# Altium project air qulity monitor.PrjPcb
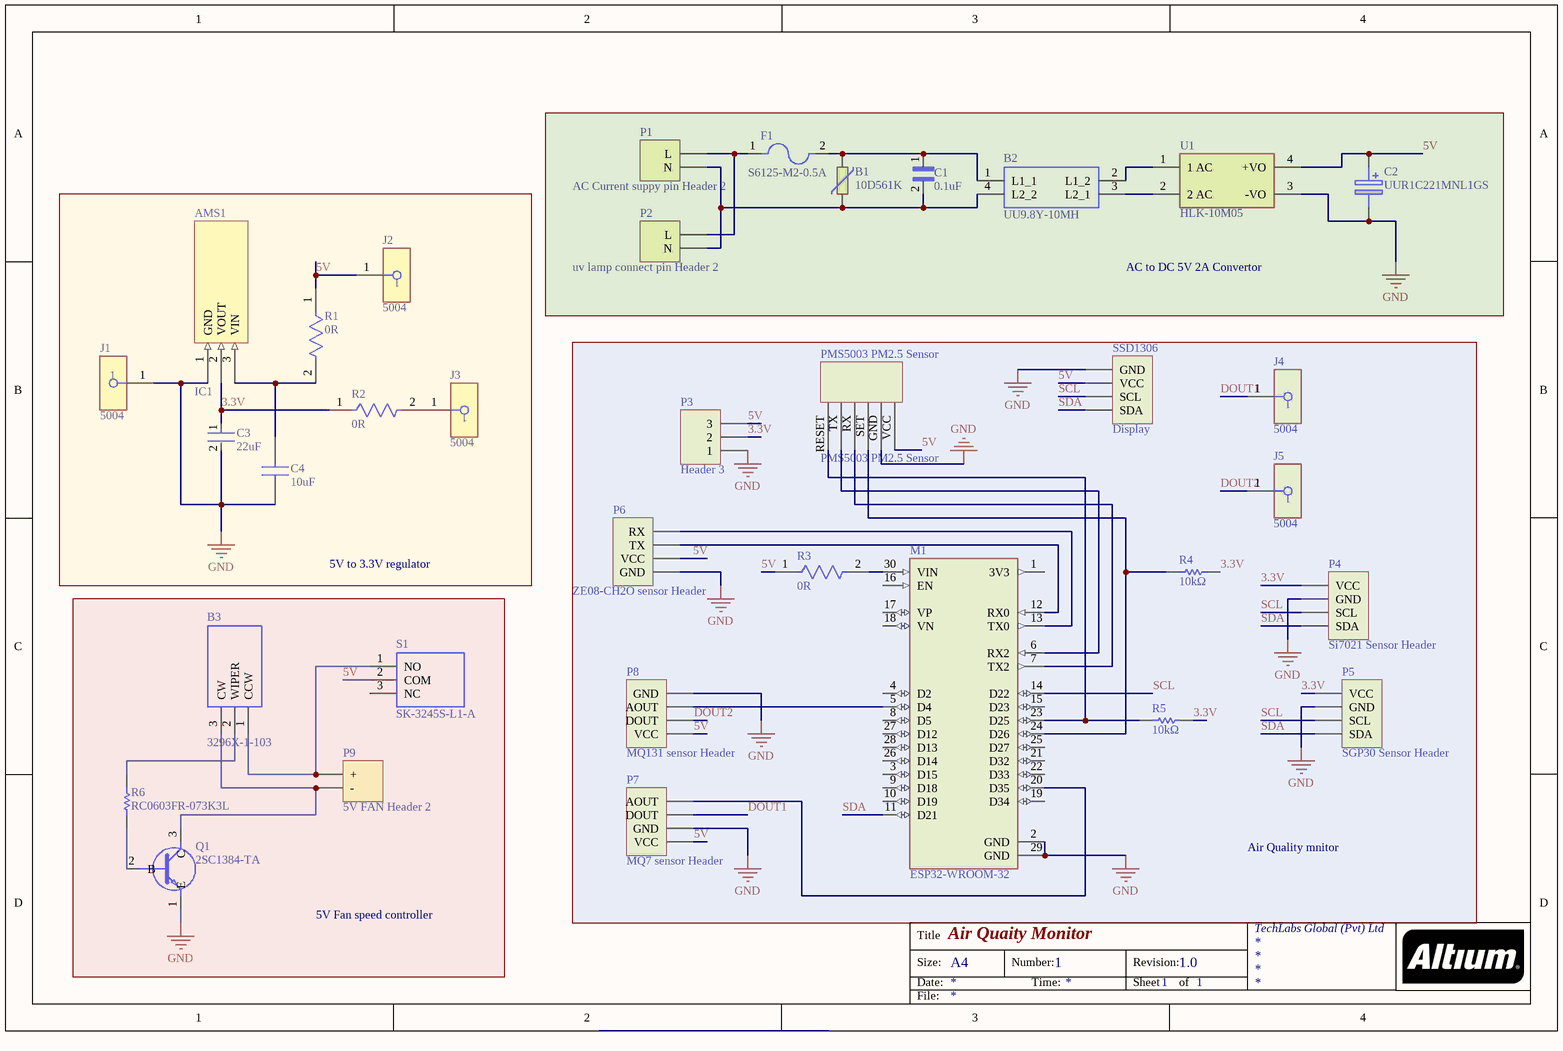
[diagram p0: air qulity monitor.SchDoc]
1 sheet, 35 parts. Net scope: global (net labels, ports and power ports of the same name join across sheets).
Board file: air qulity monitor with air purifire.PcbDoc

## Sheet air qulity monitor.SchDoc: Air Quaity Monitor
size A4; Organization: TechLabs Global (Pvt) Ltd; DocumentNumber: 1; Revision: 1.0; SheetNumber: 1; SheetTotal: 1

### Parts
AMS1  IC1  [SOT89-150P350X150-3N]
B1  10D561K  [10D561K]
B2  UU9.8Y-10MH  [UU98Y10MH]
B3  3296X-1-103  [3296X1223LF]
C1  0.1uF  [MPX-104K275VAC-C-D2]
C2  UUR1C221MNL1GS  [CAPAE830X1050N]
C3  22uF  [FP-GRM219-0_2-0_15-IPC_A]
C4  10uF  [CAPC1005X70N]
F1  S6125-M2-0.5A  [CAPC6125X25N]
J1  5004  [FP-5004-MFG]
J2  5004  [FP-5004-MFG]
J3  5004  [FP-5004-MFG]
J4  5004  [FP-5004-MFG]
J5  5004  [FP-5004-MFG]
M1  ESP32-WROOM-32  [ESP32-DEVKIT-V1]
P1  AC Current suppy pin Header 2  [HDR1X2]
P2  uv lamp connect pin Header 2  [HDR1X2]
P3  Header 3  [HDR1X3]
P4  Si7021 Sensor Header  [HDR1X4]
P5  SGP30 Sensor Header  [HDR1X4]
P6  ZE08-CH2O sensor Header  [HDR1X4]
P7  MQ7 sensor Header  [HDR1X4]
P8  MQ131 sensor Header  [HDR1X4]
P9  5V FAN Header 2  [HDR1X2]
PMS5003_PM2.5_Sensor  PMS5003 PM2.5 Sensor  [PMS5003 PM2.5 Sensor]
Q1  2SC1384-TA  [2SC1384-TA]
R1  0R  [FP-RC0402-0_4-IPC_A]
R2  0R  [FP-RC0402-0_4-IPC_A]
R3  0R  [FP-RC0402-0_4-IPC_A]
R4  10kΩ  [RESC1005X40X25LL05T10]
R5  10kΩ  [RESC1005X40X25LL05T10]
R6  RC0603FR-073K3L  [RESC1608X55X25ML10T15]
S1  SK-3245S-L1-A  [SK3245SL1A]
SSD1306  Display  [HDR1X4]
U1  HLK-10M05  [FP-HLK-10M05-MFG]

### Blocks framed on the sheet
AC to DC 5V 2A Convertor: B1 B2 C1 C2 F1 P1 P2 U1
5V to 3.3V regulator: AMS1 C3 C4 J1-J3 R1 R2
Air Quality mnitor: J4 J5 M1 P3-P8 PMS5003_PM2.5_Sensor R3-R5 SSD1306
5V Fan speed controller: B3 P9 Q1 R6 S1

### Nets
GND: AMS1.1(GND) C2.2(-) C3.2 C4.1 J1.1 M1.2(GND) M1.29(GND) P3.1 P4.2(GND) P5.2(GND) P6.1(GND) P7.2(GND) P8.4(GND) PMS5003_PM2.5_Sensor.GND Q1.1(E) SSD1306.1(GND) U1.3(-VO)
3.3V: AMS1.2(VOUT) C3.1 P3.2 P4.1(VCC) P5.1(VCC) R2.1 R4.2 R5.2
5V: C2.1(+) J2.1 P3.3 P6.2(VCC) P7.1(VCC) P8.1(VCC) PMS5003_PM2.5_Sensor.VCC R1.1 R3.1 S1.2(COM) SSD1306.2(VCC) U1.4(+VO)
DOUT1: J4.1 P7.3(DOUT)
DOUT2: J5.1 P8.2(DOUT)
SCL: M1.14(D22) P4.3(SCL) P5.3(SCL) SSD1306.3(SCL)
SDA: M1.11(D21) P4.4(SDA) P5.4(SDA) SSD1306.4(SDA)
NetAMS1_3: AMS1.3(VIN) C4.2 R1.2
NetB1_1: B1.1 B2.1(L1_1) C1.1 F1.2
NetB1_2: B1.2 B2.4(L2_2) C1.2 P1.1(N) P2.1(N)
NetB2_2: B2.2(L1_2) U1.1(1_AC)
NetB2_3: B2.3(L2_1) U1.2(2_AC)
NetB3_1: B3.1(CCW) P9.1(+) S1.1(NO)
NetB3_2: B3.2(WIPER) R6.2
NetB3_3: B3.3(CW) P9.2(-) Q1.3(C)
NetF1_1: F1.1 P1.2(L) P2.2(L)
NetJ3_1: J3.1 R2.2
NetM1_5: M1.5(D4) P8.3(AOUT)
NetM1_6: M1.6(RX2) PMS5003_PM2.5_Sensor.TX
NetM1_7: M1.7(TX2) PMS5003_PM2.5_Sensor.RX
NetM1_12: M1.12(RX0) P6.3(TX)
NetM1_13: M1.13(TX0) P6.4(RX)
NetM1_20: M1.20(D35) P7.4(AOUT)
NetM1_23: M1.23(D25) PMS5003_PM2.5_Sensor.RESET R5.1
NetM1_24: M1.24(D26) PMS5003_PM2.5_Sensor.SET R4.1
NetM1_30: M1.30(VIN) R3.2
NetQ1_2: Q1.2(B) R6.1

Not connected (* = marked no-connect by the designer): M1 1(3V3) 3(D15) 4(D2) 8(D5) 9(D18) 10(D19) 15(D23) 16(EN) 17(VP) 18(VN) 19(D34) 21(D32) 22(D33) 25(D27) 26(D14) 27(D12) 28(D13); S1 3(NC)

### Notes on the sheet
- Title
- Size:
- Date:
- A4
- Number:
- Time:
- Revision:
- Sheet
- of
- File:

### Library data of the parts
AMS1 = IC?: / 75dB@(120Hz) 1A 1.25V@(1A) ±125℃@(Tj) Fixed 3.3V~3.3V Positive 1 20V SOT-89 Linear Voltage Regulators (LDO) ROHS; Manufacturer: YONGYUTAI; Mfr. Part #: AMS1117-3.3; LCSC Part #: C2904742; Package: SOT-89; Datasheet: https://datasheet.lcsc.com/lcsc/2110121330_YONGYUTAI-AMS1117-3-3_C2904742.pdf
B1 = 10D561K: 920V 42.3J 180pF@1kHz 460V 350V 504V~616V 2.5kA Plugin Varistors ROHS; Manufacturer: Hongzhi Elec; Datasheet: https://datasheet.lcsc.com/lcsc/1811141751_Hongzhi-Elec-10D561K_C113236.pdf; LCSC Part #: C113236; Mfr. Part #: 10D561K; Package: Plugin
B2 = UU9.8Y-10MH: Common Mode Chokes / Filters Power Line 10mH @ 1kHz 500mA Through Hole RoHS; Manufacturer_Name: Guangdong Fenghua Advanced Tech; Geometry.Height: 14mm; Manufacturer_Part_Number: UU9.8Y-10MH; Mouser Part Number: *; Mouser Price/Stock: *; Arrow Part Number: *; Arrow Price/Stock: *; Mouser Testing Part Number: *; Mouser Testing Price/Stock: *; Datasheet Link: https://datasheet.lcsc.com/szlcsc/Guangdong-Fenghua-Advanced-Tech-UU9-8Y-10mH_C75192.pdf
B3 = 3296X-1-103: 3296X side adj cermet trimmer,10K 10mm; Manufacturer_Name: Bourns; Manufacturer_Part_Number: 3296X-1-103; Mouser Part Number: 652-3296X-1-103; Mouser Price/Stock: https://www.mouser.co.uk/ProductDetail/Bourns/3296X-1-103?qs=1WK3E8%252B1vGCDWmrofBGMvw%3D%3D; Arrow Part Number: 3296X-1-103; Arrow Price/Stock: https://www.arrow.com/en/products/3296x-1-103/bourns; Mouser Testing Part Number: *; Mouser Testing Price/Stock: *; Datasheet Link: https://componentsearchengine.com/Datasheets/1/3296X-1-103.pdf; Geometry.Height: 10mm
C1 = MPX-104K275VAC-C-D2: 0.1uF ±10% -40℃~+110℃ X2 275VAC Radial Leaded,P=15mm Suppression Capacitors ROHS; Manufacturer: CORETONG; LCSC Part #: C3249976; Package: Radial Leaded,P=15mm; Datasheet: https://datasheet.lcsc.com/lcsc/2207051802_CORETONG-MPX-104K275VAC-C-D2_C3249976.pdf; Mfr. Part #: MPX-104K275VAC-C-D2; Value: 0.1uF
C2 = UUR1C221MNL1GS: Nichicon 220uF 16V dc Aluminium Electrolytic Capacitor, Surface Mount 8 (Dia.) x 10mm +85C 8mm; Geometry.Height: 10.5mm; Manufacturer_Name: Nichicon; Manufacturer_Part_Number: UUR1C221MNL1GS; Mouser Part Number: 647-UUR1C221MNL1GS; Mouser Price/Stock: https://www.mouser.co.uk/ProductDetail/Nichicon/UUR1C221MNL1GS?qs=%252BzEQ4sV6YNnDp6ENSFi1fw%3D%3D; Arrow Part Number: UUR1C221MNL1GS; Arrow Price/Stock: https://www.arrow.com/en/products/uur1c221mnl1gs/nichicon; Mouser Testing Part Number: *; Mouser Testing Price/Stock: *; Datasheet Link: http://www.nichicon.co.jp/english/products/pdfs/e-uur.pdf
C3 = CMP-06035-056251-1: Chip Multilayer Ceramic Capacitors for General Purpose, 0805, 22uF, X5R, 15%, 20%, 16V; Mfr. Part #: GRM219R61C226ME15L; Manufacturer: Murata Electronics; value: 22uF; Datasheet: https://datasheet.lcsc.com/lcsc/1811141821_Murata-Electronics-GRM219R61C226ME15L_C162295.pdf; LCSC Part #: C162295; Package: 0805
C4 = CL05A106MQ5NUNC: 6.3V 10uF X5R ±20% 0402 Multilayer Ceramic Capacitors MLCC - SMD/SMT ROHS; Manufacturer: Samsung Electro-Mechanics; Mfr. Part #: CL05A106MQ5NUNC; LCSC Part #: C15525; value: 10uF; Datasheet Link: https://datasheet.datasheetarchive.com/originals/distributors/Datasheets-DGA10/2406160.pdf; Package: 0402
F1 = S6125-M2-0.5A: SMD Fuses ROHS; Manufacturer: SART(Nanjing Sart Tech); LCSC Part #: C845172; Mfr. Part #: S6125-M2-0.5A; Package: SMD; Datasheet: https://datasheet.lcsc.com/lcsc/2201242130_SART-Nanjing-Sart-Tech-S6125-M2-0-5A_C845172.pdf
J1-J5 = CMP-2000-05575-2: PC TEST POINT MINIATURE YELLOW; Manufacturer: Keystone; Datasheet: https://datasheet.lcsc.com/lcsc/2201121200_Keystone-5004_C2906762.pdf; LCSC Part #: C2906762; ComponentLink2URL: https://www.keyelco.com/product-pdf.cfm?p=1313; ComponentLink2Description: Datasheet; Package: 5004; Mfr. Part #: 5004
M1 = ESP32-DEVKIT-V1: Dual core, Wi-Fi: 2.4 GHz up to 150 Mbits/s,BLE (Bluetooth Low Energy) and legacy Bluetooth, 32 bits, Up to 240 MHz
P1 P2 P9 = Header 2: Header, 2-Pin; LatestRevisionDate: 17-Jul-2002; LatestRevisionNote: Re-released for DXP Platform.; Publisher: Altium Limited
P3 = Header 3: Header, 3-Pin; LatestRevisionDate: 17-Jul-2002; LatestRevisionNote: Re-released for DXP Platform.; Publisher: Altium Limited
P4-P8 SSD1306 = Header 4: Header, 4-Pin; LatestRevisionDate: 17-Jul-2002; LatestRevisionNote: Re-released for DXP Platform.; Publisher: Altium Limited
Q1 = 2SC1384-TA: Bipolar Transistors - BJT NPN Si Transistor Epitaxial; Manufacturer: Jiangsu Changjing Electronics Technology Co., Ltd.; Geometry.Height: 5.33mm; Mfr. Part #: 2SC1384-TA; LCSC Part #: C2910422; Datasheet: https://datasheet.lcsc.com/lcsc/2204131745_Jiangsu-Changjing-Electronics-Technology-Co---Ltd--2SC1384-TA_C2910422.pdf
R1-R3 = CMP-2002-07342-2: RES SMD 0 OHM JUMPER 1/16W 0402; Manufacturer: Yageo; Mfr. Part #: RC0402FR-070RL; value: 0R; Package: 0402; LCSC Part #: C106231; Datasheet: https://www.lcsc.com/product-detail/Chip-Resistor-Surface-Mount_YAGEO-RC0402FR-070RL_C106231.html
R4 R5 = CMP-2002-07353-1: 62.5mW 50V ±100ppm/℃ ±1% -55℃~+155℃ 10kΩ 0402 Chip Resistor - Surface Mount ROHS; Mfr. Part #: RC0402FR-0710KL; Manufacturer: Yageo / Phycomp; Datasheet: https://datasheet.lcsc.com/lcsc/1809301715_YAGEO-RC0402FR-0710KL_C60490.pdf; LCSC Part #: C60490; Package: 0402; value: 10kΩ
R6 = CMP-1012-00567-2: Chip Resistor, 3.3 KOhm, +/- 1%, 0.1 W, -55 to 155 degC, 0603 (1608 Metric), RoHS, Tape and Reel; Manufacturer: Yageo; Temperature Coefficient: 100ppm/degreesC; Voltage Rating: 50V; Max Power Dissipation: 100mW; Resistance: 3.3KOhm; Case Code (Metric): 1608; Case/Package: 0603; Composition: ThickFilm; RoHSCompliant: true; Datasheet Version: Rev. 5, 10/2016; REACH SVHC: NoSVHC; Width: 0.8mm; Package Quantity: 1; Depth: 0.8mm; Voltage Rating (DC): 50V; Termination: SMD/SMT; Length: 1.6mm; Lead Free: LeadFree; Package Description: 2-Pin Surface Mount Device, Body 1.6 x 0.8 mm; Max Operating Temperature: 155degC; Tolerance: 1%; Height: 0.45mm; Number of Pins: 2; Military Standard: Not; Power Rating: 100mW; Datasheet URL: http://www.yageo.com/NewPortal/yageodocoutput?fileName=/pdf/R-Chip/PYu-RC_Group_51_RoHS_L_5.pdf; Case Code (Imperial): 0603; Manufacturer URL: http://www.yageo.com/; Packaging: TapeandReel; Min Operating Temperature: -55degC; Package Reference: 0603; Number of Terminations: 2
S1 = SK-3245S-L1-A: Toggle switch, horizontal stick two gears 3 feet, double row of high temperature salt fog resistance 24 hours,9.0x3.5x3.2, black handle height 2.0mm; Manufacturer_Name: XKB Connectivity; Geometry.Height: 3.65mm; Manufacturer_Part_Number: SK-3245S-L1-A; Mouser Part Number: *; Mouser Price/Stock: *; Arrow Part Number: *; Arrow Price/Stock: *; Mouser Testing Part Number: *; Mouser Testing Price/Stock: *; Datasheet Link: http://www.helloxkb.com/public/images/pdf/SK-3245S-X-X.pdf
U1 = CMP-218581-000001-1: 10W Ultra-Compact Power Module